# EAGLE design lantronix-wallplug (EAGLE 9.6.2)
xPort Wallplug: mains-powered RS-232 ↔ Ethernet adapter around a Lantronix xPort Pro (16 MB flash)
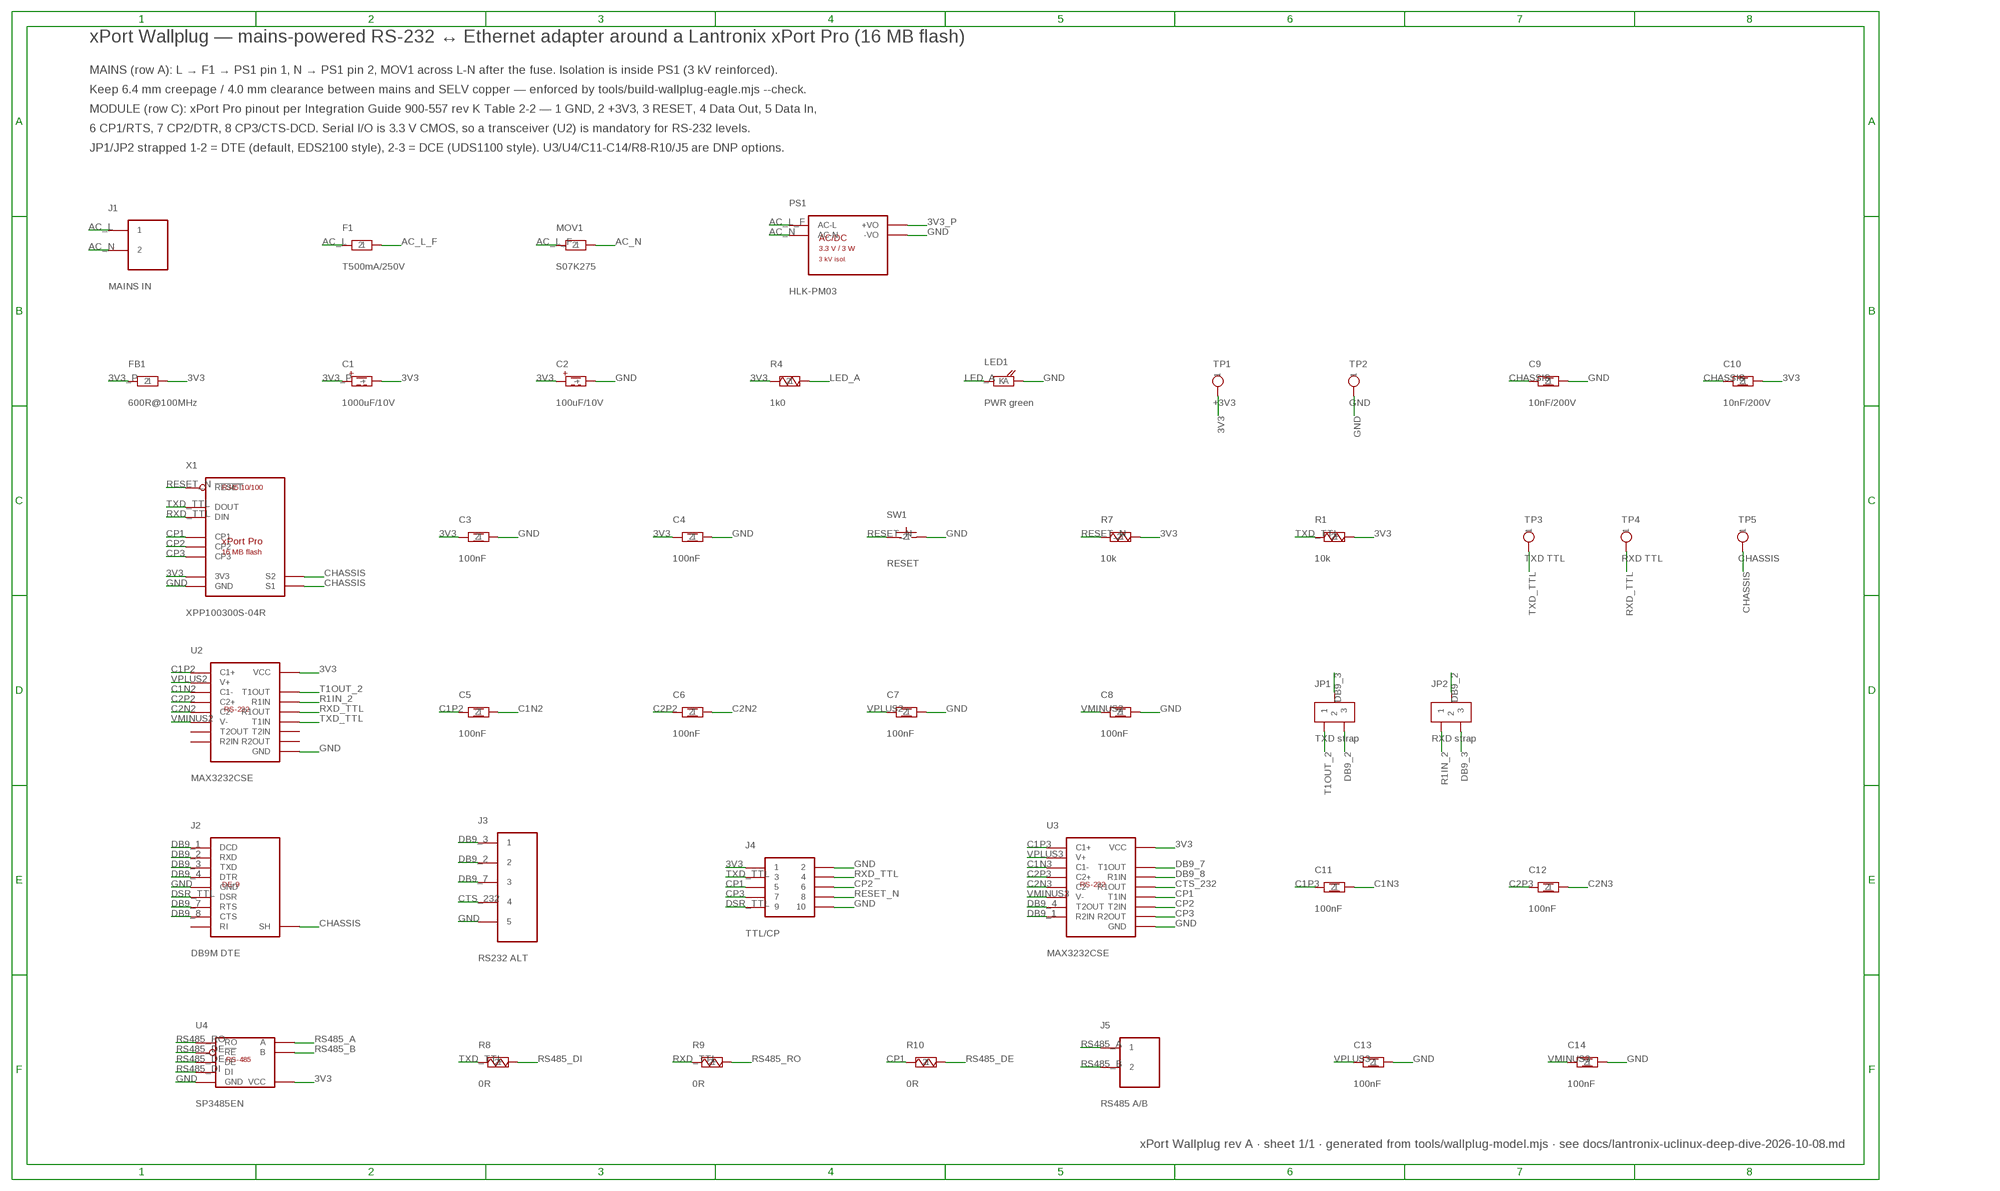
[diagram p0: schematic, sheet 1]

## Parts
C1  1000uF/10V  CPOL-EU  [CP-D10-P5]
C2  100uF/10V  CPOL-SMALL  [CP-D6.3-P2.5]
C3  100nF  C-EU  [C-5.08]
C4  100nF  C-EU  [C-5.08]
C5  100nF  C-EU  [C-5.08]
C6  100nF  C-EU  [C-5.08]
C7  100nF  C-EU  [C-5.08]
C8  100nF  C-EU  [C-5.08]
C9  10nF/200V  C-200V  [C-5.08-200V]
C10  10nF/200V  C-200V  [C-5.08-200V]
C11  100nF  C-EU  [C-5.08]
C12  100nF  C-EU  [C-5.08]
C13  100nF  C-EU  [C-5.08]
C14  100nF  C-EU  [C-5.08]
F1  T500mA/250V  FUSE  [FUSE-RADIAL]
FB1  600R@100MHz  FERRITE  [FB-7.62]
J1  MAINS IN  TERM-2  [TERM2-5.08]
J2  DB9M DTE  DB9M  [DB9MRA]
J3  RS232 ALT  TERM-5  [TERM5-5.08]
J4  TTL/CP  HDR-2X5  [HDR-2X5]
J5  RS485 A/B  TERM-2  [TERM2-5.08]
JP1  TXD strap  SJ-3  [SJ-3]
JP2  RXD strap  SJ-3  [SJ-3]
LED1  PWR green  LED  [LED-5MM]
MOV1  S07K275  MOV  [MOV07]
PS1  HLK-PM03  ACDC-3V3  [HLKPM03]
R1  10k  R-EU  [R-7.62]
R4  1k0  R-EU  [R-7.62]
R7  10k  R-EU  [R-7.62]
R8  0R  R-EU  [R-7.62]
R9  0R  R-EU  [R-7.62]
R10  0R  R-EU  [R-7.62]
SW1  RESET  SW-PUSH  [SW-TACT-6MM]
TP1  +3V3  TP  [TP]
TP2  GND  TP  [TP]
TP3  TXD TTL  TP  [TP]
TP4  RXD TTL  TP  [TP]
TP5  CHASSIS  TP  [TP]
U2  MAX3232CSE  MAX3232  [SO16]
U3  MAX3232CSE  MAX3232  [SO16]
U4  SP3485EN  SP3485  [SO8]
X1  XPP100300S-04R  XPORT-PRO  [XPORTPRO]

## Nets
3V3 [power]: C1.- C2.+ C3.1 C4.1 C10.2 FB1.2 J4.1 R1.2 R4.1 R7.2 TP1.1 U2.16(VCC) U3.16(VCC) U4.8(VCC) X1.2(3V3)
3V3_P [power]: C1.+ FB1.1 PS1.4(+VO)
AC_L [mains]: F1.1 J1.1
AC_L_F [mains]: F1.2 MOV1.1 PS1.1(AC-L)
AC_N [mains]: J1.2 MOV1.2 PS1.2(AC-N)
C1N2: C5.2 U2.3(C1-)
C1N3: C11.2 U3.3(C1-)
C1P2: C5.1 U2.1(C1+)
C1P3: C11.1 U3.1(C1+)
C2N2: C6.2 U2.5(C2-)
C2N3: C12.2 U3.5(C2-)
C2P2: C6.1 U2.4(C2+)
C2P3: C12.1 U3.4(C2+)
CHASSIS [power]: C9.1 C10.1 J2.MH(SH) TP5.1 X1.S1 X1.S2
CP1: J4.5 R10.1 U3.11(T1IN) X1.6(CP1)
CP2: J4.6 U3.10(T2IN) X1.7(CP2)
CP3: J4.7 U3.9(R2OUT) X1.8(CP3)
CTS_232: J3.4 U3.12(R1OUT)
DB9_1: J2.1(DCD) U3.8(R2IN)
DB9_2: J2.2(RXD) J3.2 JP1.3 JP2.2
DB9_3: J2.3(TXD) J3.1 JP1.2 JP2.3
DB9_4: J2.4(DTR) U3.7(T2OUT)
DB9_7: J2.7(RTS) J3.3 U3.14(T1OUT)
DB9_8: J2.8(CTS) U3.13(R1IN)
DSR_TTL: J2.6(DSR) J4.9
GND [power]: C2.- C3.2 C4.2 C7.2 C8.2 C9.2 C13.2 C14.2 J2.5(GND) J3.5 J4.2 J4.10 LED1.2(K) PS1.3(-VO) SW1.2 TP2.1 U2.15(GND) U3.15(GND) U4.5(GND) X1.1(GND)
LED_A: LED1.1(A) R4.2
R1IN_2: JP2.1 U2.13(R1IN)
RESET_N: J4.8 R7.1 SW1.1 X1.3(!RESET)
RS485_A: J5.1 U4.6(A)
RS485_B: J5.2 U4.7(B)
RS485_DE: R10.2 U4.2(!RE) U4.3(DE)
RS485_DI: R8.2 U4.1(DI)
RS485_RO: R9.2 U4.4(RO)
RXD_TTL: J4.4 R9.1 TP4.1 U2.12(R1OUT) X1.5(DIN)
T1OUT_2: JP1.1 U2.14(T1OUT)
TXD_TTL: J4.3 R1.1 R8.1 TP3.1 U2.11(T1IN) X1.4(DOUT)
VMINUS2: C8.1 U2.6(V-)
VMINUS3: C14.1 U3.6(V-)
VPLUS2: C7.1 U2.2(V+)
VPLUS3: C13.1 U3.2(V+)
Unconnected: J2.9(RI) U2.7(T2OUT) U2.8(R2IN) U2.9(R2OUT) U2.10(T2IN)

## Notes on the sheet
- xPort Wallplug — mains-powered RS-232 ↔ Ethernet adapter around a Lantronix xPort Pro (16 MB flash)
- MAINS (row A): L → F1 → PS1 pin 1, N → PS1 pin 2, MOV1 across L-N after the fuse. Isolation is inside PS1 (3 kV reinforced).
- Keep 6.4 mm creepage / 4.0 mm clearance between mains and SELV copper — enforced by tools/build-wallplug-eagle.mjs --check.
- MODULE (row C): xPort Pro pinout per Integration Guide 900-557 rev K Table 2-2 — 1 GND, 2 +3V3, 3 RESET, 4 Data Out, 5 Data In,
- 6 CP1/RTS, 7 CP2/DTR, 8 CP3/CTS-DCD. Serial I/O is 3.3 V CMOS, so a transceiver (U2) is mandatory for RS-232 levels.
- JP1/JP2 strapped 1-2 = DTE (default, EDS2100 style), 2-3 = DCE (UDS1100 style). U3/U4/C11-C14/R8-R10/J5 are DNP options.
- xPort Wallplug rev A · sheet 1/1 · generated from tools/wallplug-model.mjs · see docs/lantronix-uclinux-deep-dive-2026-10-08.md

## Library data of the parts
C1 = lantronix-wallplug:CPOL-EU
C2 = lantronix-wallplug:CPOL-SMALL
C3-C8 C11-C14 = lantronix-wallplug:C-EU
C9 C10 = lantronix-wallplug:C-200V
F1 = lantronix-wallplug:FUSE
FB1 = lantronix-wallplug:FERRITE
J1 J5 = lantronix-wallplug:TERM-2
J2 = lantronix-wallplug:DB9M
J3 = lantronix-wallplug:TERM-5
J4 = lantronix-wallplug:HDR-2X5
JP1 JP2 = lantronix-wallplug:SJ-3
LED1 = lantronix-wallplug:LED
MOV1 = lantronix-wallplug:MOV
PS1 = lantronix-wallplug:ACDC-3V3
R1 R4 R7-R10 = lantronix-wallplug:R-EU
SW1 = lantronix-wallplug:SW-PUSH
TP1-TP5 = lantronix-wallplug:TP
U2 U3 = lantronix-wallplug:MAX3232
U4 = lantronix-wallplug:SP3485
X1 = lantronix-wallplug:XPORT-PRO

## Net classes
0 default: width 0.305 mm
1 mains: width 2.5 mm, clearance 6.4 mm to class 0, clearance 6.4 mm, clearance 6.4 mm to class 2
2 power: width 1 mm, clearance 0.5 mm to class 0, clearance 0.6 mm

## Board
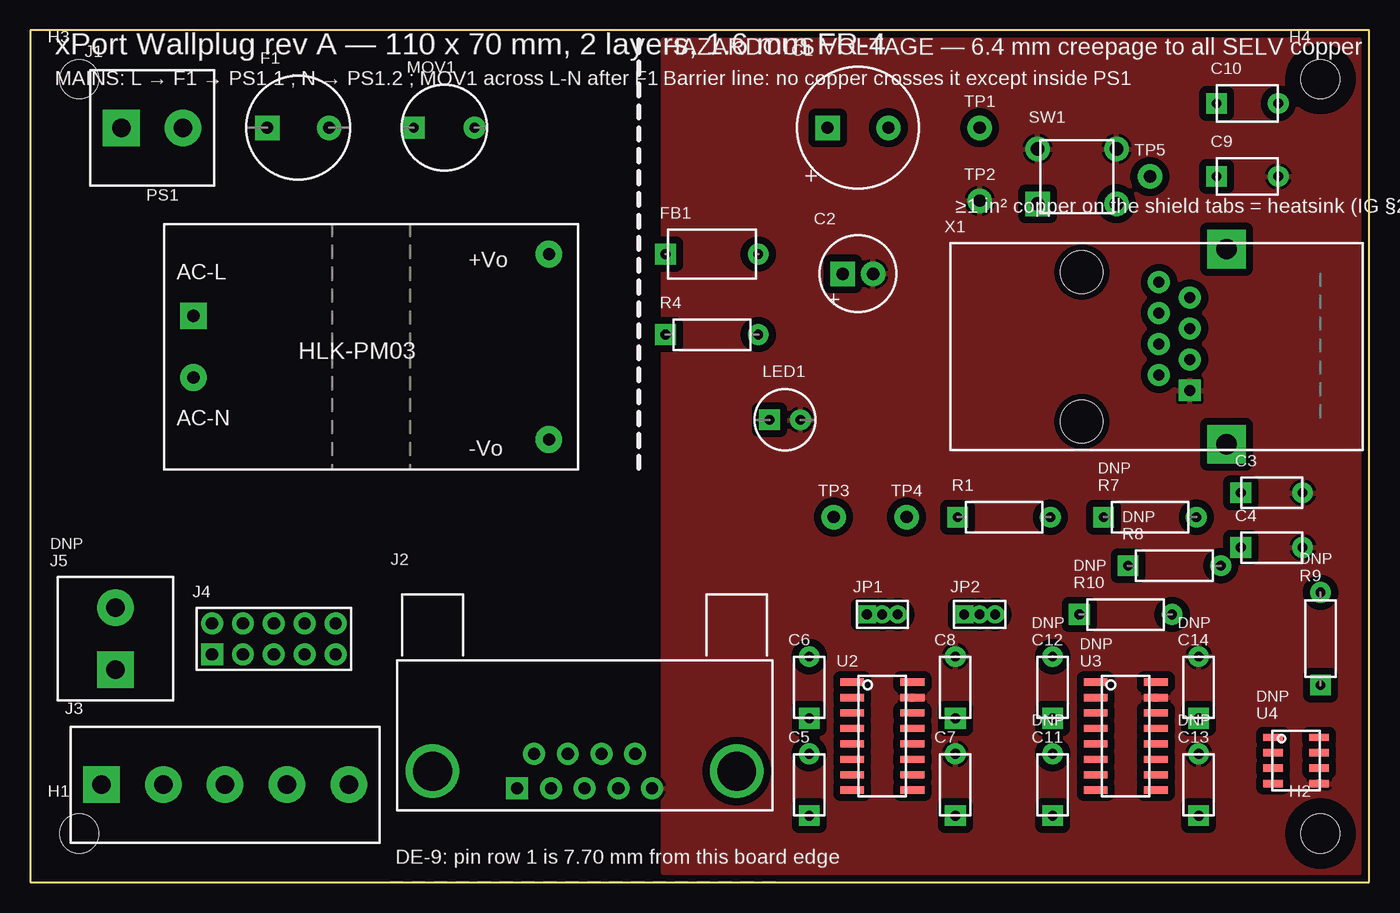
[diagram p1: board, top side]
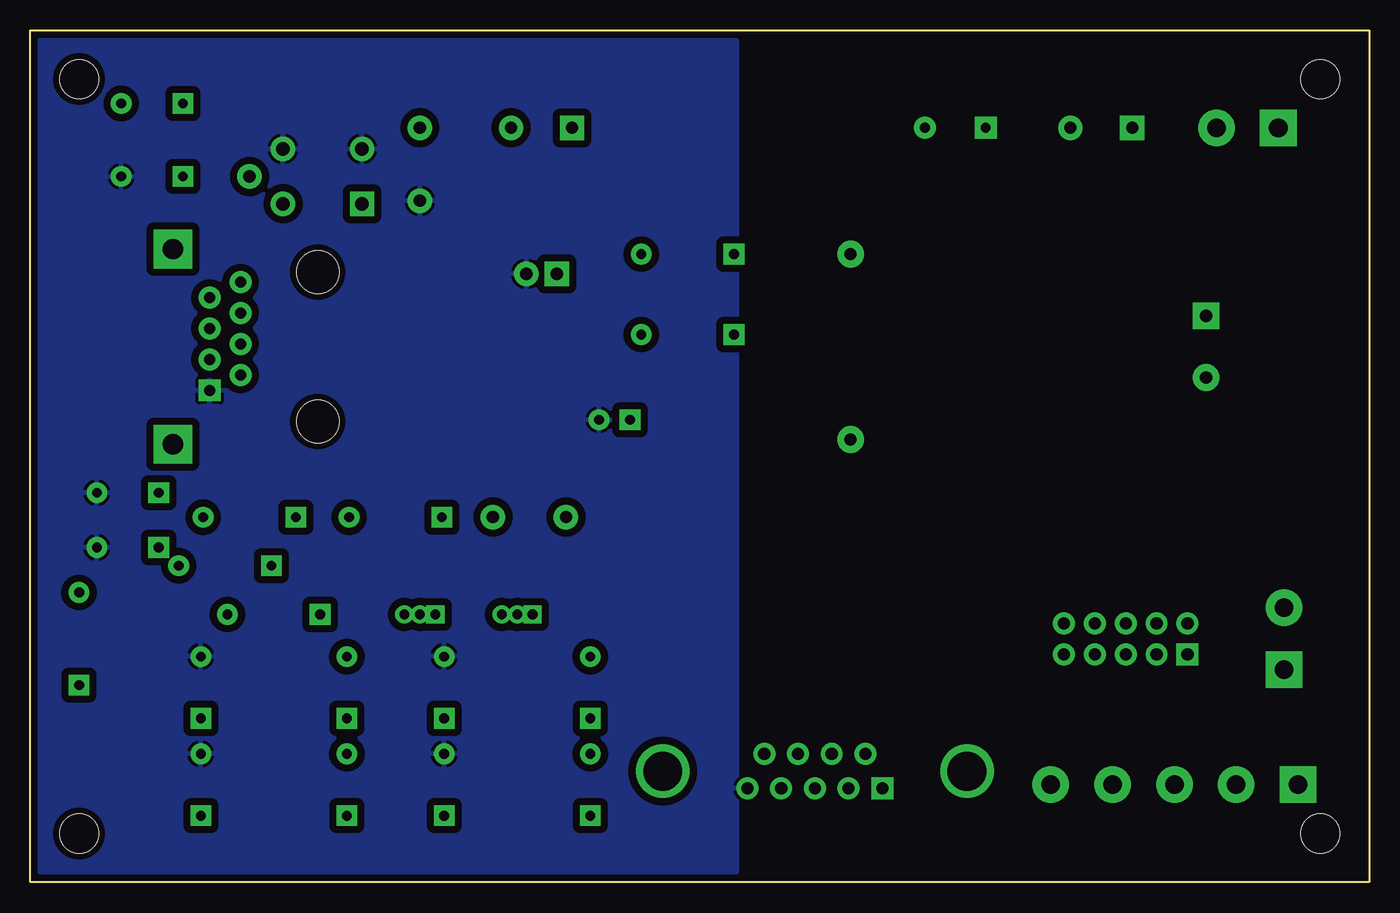
[diagram p2: board, bottom side, seen from below]

Size 110 x 70 mm. Coordinates in mm from the lower left corner, seen from the top.
Outline: 0,0 110,0 110,70 0,70 0,0
Copper layers (1*16): Top 0.035mm / dielectric 1.5mm / Bottom 0.035mm
Design rules "lantronix-wallplug-2layer": minimum track width 8mil, minimum drill 0.35mm, track to track 8mil, track to pad 8mil, pad to pad 8mil, via to via 8mil, smd to smd 0mil, copper to edge 20mil, drill to drill 8mil, minimum pad ring 10mil, minimum via ring 8mil, stop-mask expansion 4mil, vias tented up to drill 25mil, thermal gap 10mil
tRestrict: 1 lines

### Footprints (pad centres in the part's own frame; a part is rotated, then mirrored left to right if it is on the bottom)
CP-D10-P5 = drill 1 pad 2 square: + -2.5,0 | drill 1 pad 2: - 2.5,0
CP-D6.3-P2.5 = drill 1 pad 2 square: + -1.25,0 | drill 1 pad 2: - 1.25,0
C-5.08 = drill 0.8 pad 1.7 square: 1 -2.54,0 | drill 0.8 pad 1.7: 2 2.54,0
C-5.08-200V = drill 0.8 pad 1.7 square: 1 -2.54,0 | drill 0.8 pad 1.7: 2 2.54,0
FUSE-RADIAL = drill 1 pad 2 square: 1 -2.54,0 | drill 1 pad 2: 2 2.54,0
FB-7.62 = drill 0.8 pad 1.7 square: 1 -3.81,0 | drill 0.8 pad 1.7: 2 3.81,0
MOUNT-M3 = hole 3.2: 0,0
TERM2-5.08 = drill 1.52 pad 3 square: 1 -2.54,0 | drill 1.52 pad 3: 2 2.54,0
DB9MRA = drill 1 pad 1.8 square: 1 0,0 | drill 1 pad 1.8: 2 2.77,0; 3 5.54,0; 4 8.31,0; 5 11.08,0; 6 1.385,2.84; 7 4.155,2.84; 8 6.925,2.84; 9 9.695,2.84 | drill 3.2 pad 4.4: MH -6.96,1.42; MH 18.04,1.42
TERM5-5.08 = drill 1.52 pad 3 square: 1 -10.16,0 | drill 1.52 pad 3: 2 -5.08,0; 3 0,0; 4 5.08,0; 5 10.16,0
HDR-2X5 = drill 1 pad 1.8 square: 1 -5.08,-1.27 | drill 1 pad 1.8: 2 -5.08,1.27; 3 -2.54,-1.27; 4 -2.54,1.27; 5 0,-1.27; 6 0,1.27; 7 2.54,-1.27; 8 2.54,1.27; 9 5.08,-1.27; 10 5.08,1.27
SJ-3 = drill 0.8 pad 1.5 square: 1 -1.27,0 | drill 0.8 pad 1.5: 2 0,0; 3 1.27,0
LED-5MM = drill 0.8 pad 1.7 square: 1 -1.27,0 | drill 0.8 pad 1.7: 2 1.27,0
MOV07 = drill 0.8 pad 1.8 square: 1 -2.5,0 | drill 0.8 pad 1.8: 2 2.5,0
HLKPM03 = drill 1 pad 2.2 square: 1 -14.605,2.54 | drill 1 pad 2.2: 2 -14.605,-2.54; 3 14.605,-7.62; 4 14.605,7.62
R-7.62 = drill 0.8 pad 1.7 square: 1 -3.81,0 | drill 0.8 pad 1.7: 2 3.81,0
SW-TACT-6MM = drill 1.1 pad 2 square: 1 -3.25,-2.25 | drill 1.1 pad 2: 1 3.25,-2.25; 2 -3.25,2.25; 2 3.25,2.25
TP = drill 1 pad 2: 1 0,0
SO16 = smd 1.95 x 0.6: 1 -2.475,4.445; 2 -2.475,3.175; 3 -2.475,1.905; 4 -2.475,0.635; 5 -2.475,-0.635; 6 -2.475,-1.905; 7 -2.475,-3.175; 8 -2.475,-4.445; 9 2.475,-4.445; 10 2.475,-3.175; 11 2.475,-1.905; 12 2.475,-0.635; 13 2.475,0.635; 14 2.475,1.905; 15 2.475,3.175; 16 2.475,4.445
SO8 = smd 1.6 x 0.6: 1 -1.9,1.905; 2 -1.9,0.635; 3 -1.9,-0.635; 4 -1.9,-1.905; 5 1.9,-1.905; 6 1.9,-0.635; 7 1.9,0.635; 8 1.9,1.905
XPORTPRO = drill 0.9 pad 1.8 square: 1 1.27,-3.58 | drill 0.9 pad 1.8: 2 -1.27,-2.31; 3 1.27,-1.04; 4 -1.27,0.23; 5 1.27,1.5; 6 -1.27,2.77; 7 1.27,4.04; 8 -1.27,5.31 | drill 1.676 pad 3.175 square: S1 4.28,8.025; S2 4.28,-8.025 | hole 3.5: -7.62,6.15; -7.62,-6.15

### Placement (x,y rotation side)
C1  68,62 0 top
C2  68,50 0 top
C3  102,32 0 top
C4  102,27.5 0 top
C5  64,8 90 top
C6  64,16 90 top
C7  76,8 90 top
C8  76,16 90 top
C9  100,58 0 top
C10  100,64 0 top
C11  84,8 90 top
C12  84,16 90 top
C13  96,8 90 top
C14  96,16 90 top
F1  22,62 0 top
FB1  56,51.62 0 top
H1  [MOUNT-M3]  4,4 0 top
H2  [MOUNT-M3]  106,4 0 top
H3  [MOUNT-M3]  4,66 0 top
H4  [MOUNT-M3]  106,66 0 top
J1  10,62 0 top
J2  40,7.7 0 top
J3  16,8 0 top
J4  20,20 0 top
J5  7,20 90 top
JP1  70,22 0 top
JP2  78,22 0 top
LED1  62,38 0 top
MOV1  34,62 0 top
PS1  28,44 0 top
R1  80,30 0 top
R4  56,45 0 top
R7  92,30 0 top
R8  94,26 0 top
R9  106,20 90 top
R10  90,22 0 top
SW1  86,58 0 top
TP1  78,62 0 top
TP2  78,56 0 top
TP3  66,30 0 top
TP4  72,30 0 top
TP5  92,58 0 top
U2  70,12 0 top
U3  90,12 0 top
U4  104,10 0 top
X1  94,44 0 top

### Tracks (layer width: path | path; a pad name or v marks a point on that pad's centre or on a via)
GND
  pour Top (isolate 0.4, rank 2): 52,0.8 109.2,0.8 109.2,69.2 52,69.2
  pour Bottom (isolate 0.4, rank 2): 52,0.8 109.2,0.8 109.2,69.2 52,69.2

### Text on the board
tPlace: xPort Wallplug rev A — 110 x 70 mm, 2 layers, 1.6 mm FR-4 | HAZARDOUS VOLTAGE — 6.4 mm creepage to all SELV copper | MAINS: L → F1 → PS1.1 ; N → PS1.2 ; MOV1 across L-N after F1 | Barrier line: no copper crosses it except inside PS1 | ≥1 in² copper on the shield tabs = heatsink (IG §2) | DE-9: pin row 1 is 7.70 mm from this board edge